# Altium project RFSoC-AMC.PrjPCB (part 18 of 22)

## Sheet FPGA_7A35T.SchDoc: RFSoC AMC
size 420 x 297 mm; CompanyName: WUT; DrawnBy: T. Przywozki; Organization: WUT ISE; Address1: Warsaw University of Technology; Address2: Nowowiejska 15/19 00-665 Warsaw; Address3: Tomasz.Przywozki@pw.edu.pl; DocumentNumber: 15; Revision: 1; SheetNumber: 15; SheetTotal: 45; Project: RFSoC AMC; ModifiedBy: T. Przywozki; CreateDate: -; CheckedDate: -; DivGrp: ISE; Designer: T. Przywozki; ModifiedDate: -; ProjectName: ADC/DAC MEZZANINE
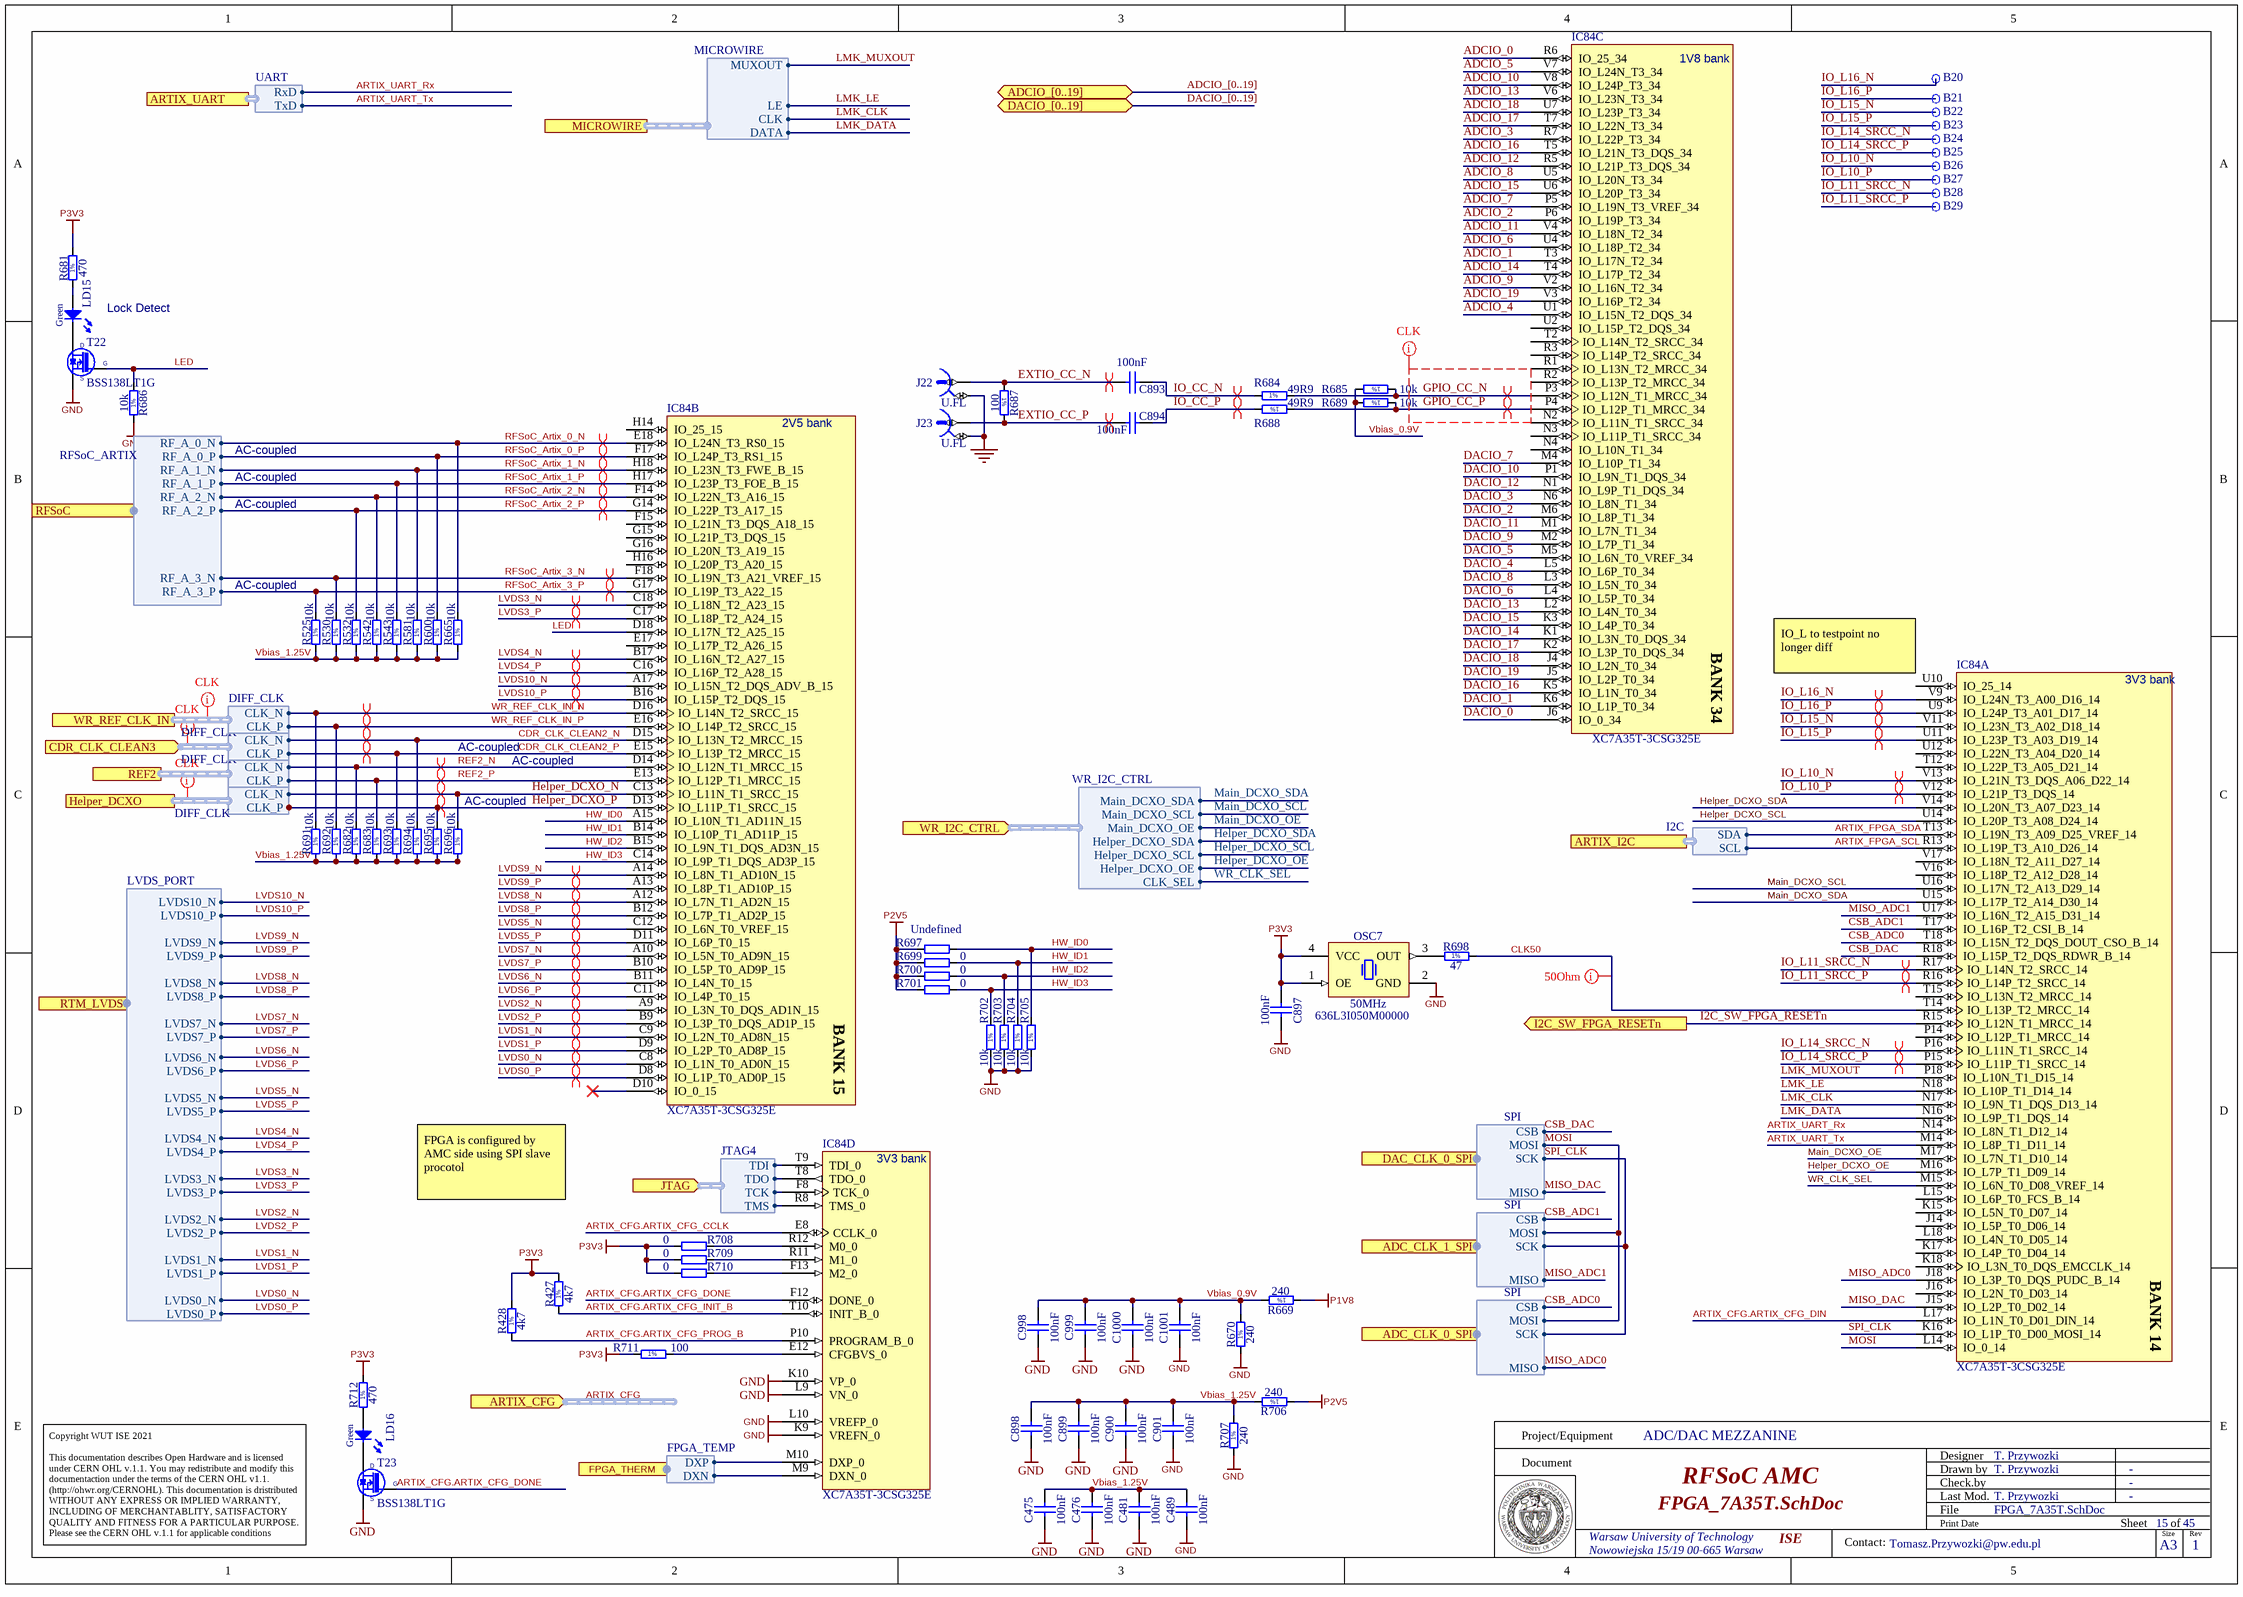
[diagram p40: FPGA_7A35T.SchDoc]

### Parts
B20  SMD_PAD_D1MM  [C100]  (value not drawn)
B21  SMD_PAD_D1MM  [C100]  (value not drawn)
B22  SMD_PAD_D1MM  [C100]  (value not drawn)
B23  SMD_PAD_D1MM  [C100]  (value not drawn)
B24  SMD_PAD_D1MM  [C100]  (value not drawn)
B25  SMD_PAD_D1MM  [C100]  (value not drawn)
B26  SMD_PAD_D1MM  [C100]  (value not drawn)
B27  SMD_PAD_D1MM  [C100]  (value not drawn)
B28  SMD_PAD_D1MM  [C100]  (value not drawn)
B29  SMD_PAD_D1MM  [C100]  (value not drawn)
C475  100nF  [CAPC0603X33N]
C476  100nF  [CAPC0603X33N]
C481  100nF  [CAPC0603X33N]
C489  100nF  [CAPC0603X33N]
C893  100nF  [CAPC1005X55N]
C894  100nF  [CAPC1005X55N]
C897  100nF  [CAPC0603X33N]
C898  100nF  [CAPC0603X33N]
C899  100nF  [CAPC0603X33N]
C900  100nF  [CAPC0603X33N]
C901  100nF  [CAPC0603X33N]
C998  100nF  [CAPC0603X33N]
C999  100nF  [CAPC0603X33N]
C1000  100nF  [CAPC0603X33N]
C1001  100nF  [CAPC0603X33N]
IC84  XC7A35T-3CSG325E  [CSG325]  (parts A,B,C,D of 9)
J22  U.FL  [HIROSE_U.FL-R-SMT-1(10)]
J23  U.FL  [HIROSE_U.FL-R-SMT-1(10)]
LD15  Green  [LED_KINGBRIGHT_KPH-1608CGCK]
LD16  Green  [LED_KINGBRIGHT_KPH-1608CGCK]
OSC7  50MHz  Manufacturer Part Number: 636L3I050M00000  [OSCSC254P320X500X130-4N]
R427  4k7  [RESC1005X40N]
R428  4k7  [RESC1005X40N]
R525  10k  [RESC1005X40N]
R530  10k  [RESC1005X40N]
R532  10k  [RESC1005X40N]
R542  10k  [RESC1005X40N]
R543  10k  [RESC1005X40N]
R581  10k  [RESC1005X40N]
R600  10k  [RESC1005X40N]
R665  10k  [RESC1005X40N]
R669  240  [RESC1005X40N]
R670  240  [RESC1005X40N]
R681  470  [RESC1005X40N]
R682  10k  [RESC1005X40N]
R683  10k  [RESC1005X40N]
R684  49R9  [RESC1005X40N]
R685  10k  [RESC1005X40N]
R686  10k  [RESC1005X40N]
R687  100  [RESC1005X40N]
R688  49R9  [RESC1005X40N]
R689  10k  [RESC1005X40N]
R691  10k  [RESC1005X40N]
R692  10k  [RESC1005X40N]
R693  10k  [RESC1005X40N]
R694  10k  [RESC1005X40N]
R695  10k  [RESC1005X40N]
R696  10k  [RESC1005X40N]
R697  Undefined  [RESC1005X40N]
R698  47  [RESC1005X40N]
R699  0  [RESC1005X40N]
R700  0  [RESC1005X40N]
R701  0  [RESC1005X40N]
R702  10k  [RESC1005X40N]
R703  10k  [RESC1005X40N]
R704  10k  [RESC1005X40N]
R705  10k  [RESC1005X40N]
R706  240  [RESC1005X40N]
R707  240  [RESC1005X40N]
R708  0  [RESC1005X40N]
R709  0  [RESC1005X40N]
R710  0  [RESC1005X40N]
R711  100  [RESC1005X40N]
R712  470  [RESC1005X40N]
T22  BSS138LT1G  [SOT95P240X110-3N]
T23  BSS138LT1G  [SOT95P240X110-3N]

### Ports
ADC_CLK_0_SPI (harness SPI), ADC_CLK_1_SPI (harness SPI), ADCIO_[0..19] (bidir), ARTIX_CFG (in, harness ARTIX_CFG), ARTIX_I2C (harness I2C), ARTIX_UART (harness UART), CDR_CLK_CLEAN3 (in, harness DIFF_CLK), DAC_CLK_0_SPI (harness SPI), DACIO_[0..19] (bidir), FPGA_THERM (harness FPGA_TEMP), Helper_DCXO (harness DIFF_CLK), I2C_SW_FPGA_RESETn (out), JTAG (in, harness JTAG4), MICROWIRE (harness MICROWIRE), REF2 (harness DIFF_CLK), RFSoC (harness RFSoC_ARTIX), RTM_LVDS (harness LVDS_PORT), WR_I2C_CTRL (in, harness WR_I2C_CTRL), WR_REF_CLK_IN (harness DIFF_CLK)

### Harnesses
JTAG4: TCK, TDI, TDO, TMS
UART: RxD, TxD
I2C: SCL, SDA
WR_I2C_CTRL: CLK_SEL, Helper_DCXO_OE, Helper_DCXO_SCL, Helper_DCXO_SDA, Main_DCXO_OE, Main_DCXO_SCL, Main_DCXO_SDA
FPGA_TEMP: DXP, DXN
SPI: MOSI, MISO, CSB, SCK
MICROWIRE: CLK, DATA, LE, MUXOUT
DIFF_CLK: CLK_P, CLK_N
RFSoC_ARTIX: RF_A_0_N, RF_A_0_P, RF_A_1_N, RF_A_1_P, RF_A_2_N, RF_A_2_P, RF_A_3_N, RF_A_3_P
LVDS_PORT: LVDS0_P, LVDS0_N, LVDS1_P, LVDS1_N, LVDS2_P, LVDS2_N, LVDS3_P, LVDS3_N, LVDS4_P, LVDS4_N, LVDS5_P, LVDS5_N, LVDS6_P, LVDS6_N, LVDS7_P, LVDS7_N, LVDS8_P, LVDS8_N, LVDS9_P, LVDS9_N, LVDS10_P, LVDS10_N

### Nets
GND: C475.2 C476.2 C481.2 C489.2 C897.1 C898.2 C899.2 C900.2 C901.2 C998.2 C999.2 C1000.2 C1001.2 IC84.K9(VREFN_0) IC84.K10(VP_0) IC84.L9(VN_0) IC84.L10(VREFP_0) J22.2 J23.2 OSC7.2(GND) R670.1 R686.1 R702.1 R703.1 R704.1 R705.1 R707.1 T22.2(S) T23.2(S)
P1V8: R669.1
P2V5: R697.1 R699.1 R700.1 R701.1 R706.1
P3V3: C897.2 OSC7.1(OE) OSC7.4(VCC) R427.2 R428.2 R681.2 R708.1 R709.1 R710.1 R711.1 R712.2
ADCIO_0: IC84.R6(IO_25_34)
ADCIO_1: IC84.T3(IO_L17N_T2_34)
ADCIO_2: IC84.P6(IO_L19P_T3_34)
ADCIO_3: IC84.R7(IO_L22P_T3_34)
ADCIO_4: IC84.U1(IO_L15N_T2_DQS_34)
ADCIO_5: IC84.V7(IO_L24N_T3_34)
ADCIO_6: IC84.U4(IO_L18P_T2_34)
ADCIO_7: IC84.P5(IO_L19N_T3_VREF_34)
ADCIO_8: IC84.U5(IO_L20N_T3_34)
ADCIO_9: IC84.V2(IO_L16N_T2_34)
ADCIO_10: IC84.V8(IO_L24P_T3_34)
ADCIO_11: IC84.V4(IO_L18N_T2_34)
ADCIO_12: IC84.R5(IO_L21P_T3_DQS_34)
ADCIO_13: IC84.V6(IO_L23N_T3_34)
ADCIO_14: IC84.T4(IO_L17P_T2_34)
ADCIO_15: IC84.U6(IO_L20P_T3_34)
ADCIO_16: IC84.T5(IO_L21N_T3_DQS_34)
ADCIO_17: IC84.T7(IO_L22N_T3_34)
ADCIO_18: IC84.U7(IO_L23P_T3_34)
ADCIO_19: IC84.V3(IO_L16P_T2_34)
ARTIX_CFG.ARTIX_CFG_CCLK: IC84.E8(CCLK_0)
ARTIX_CFG.ARTIX_CFG_DIN: IC84.L17(IO_L1N_T0_D01_DIN_14)
ARTIX_CFG.ARTIX_CFG_DONE: IC84.F12(DONE_0) T23.1(G)
ARTIX_CFG.ARTIX_CFG_INIT_B: IC84.T10(INIT_B_0) R427.1
ARTIX_CFG.ARTIX_CFG_PROG_B: IC84.P10(PROGRAM_B_0) R428.1
ARTIX_FPGA_SCL: IC84.R13(IO_L19P_T3_A10_D26_14) ; port ARTIX_I2C.SCL
ARTIX_FPGA_SDA: IC84.T13(IO_L19N_T3_A09_D25_VREF_14) ; port ARTIX_I2C.SDA
ARTIX_TCK: IC84.F8(TCK_0) ; port JTAG.TCK
ARTIX_TDI: IC84.T9(TDI_0) ; port JTAG.TDI
ARTIX_TDO: IC84.T8(TDO_0) ; port JTAG.TDO
ARTIX_TMS: IC84.R8(TMS_0) ; port JTAG.TMS
ARTIX_UART_Rx: IC84.N14(IO_L8N_T1_D12_14) ; port ARTIX_UART.RxD
ARTIX_UART_Tx: IC84.M14(IO_L8P_T1_D11_14) ; port ARTIX_UART.TxD
CDR_CLK_CLEAN2_N: IC84.D15(IO_L13N_T2_MRCC_15) R694.2 ; port CDR_CLK_CLEAN3.CLK_N
CDR_CLK_CLEAN2_P: IC84.E15(IO_L13P_T2_MRCC_15) R693.2 ; port CDR_CLK_CLEAN3.CLK_P
CLK50: IC84.T14(IO_L13P_T2_MRCC_14) R698.2
CSB_ADC0: IC84.T18(IO_L15N_T2_DQS_DOUT_CSO_B_14) ; port ADC_CLK_0_SPI.CSB
CSB_ADC1: IC84.T17(IO_L16P_T2_CSI_B_14) ; port ADC_CLK_1_SPI.CSB
CSB_DAC: IC84.R18(IO_L15P_T2_DQS_RDWR_B_14) ; port DAC_CLK_0_SPI.CSB
DACIO_0: IC84.J6(IO_0_34)
DACIO_1: IC84.K6(IO_L1P_T0_34)
DACIO_2: IC84.M6(IO_L8P_T1_34)
DACIO_3: IC84.N6(IO_L8N_T1_34)
DACIO_4: IC84.L5(IO_L6P_T0_34)
DACIO_5: IC84.M5(IO_L6N_T0_VREF_34)
DACIO_6: IC84.L4(IO_L5P_T0_34)
DACIO_7: IC84.M4(IO_L10P_T1_34)
DACIO_8: IC84.L3(IO_L5N_T0_34)
DACIO_9: IC84.M2(IO_L7P_T1_34)
DACIO_10: IC84.P1(IO_L9N_T1_DQS_34)
DACIO_11: IC84.M1(IO_L7N_T1_34)
DACIO_12: IC84.N1(IO_L9P_T1_DQS_34)
DACIO_13: IC84.L2(IO_L4N_T0_34)
DACIO_14: IC84.K1(IO_L3N_T0_DQS_34)
DACIO_15: IC84.K3(IO_L4P_T0_34)
DACIO_16: IC84.K5(IO_L1N_T0_34)
DACIO_17: IC84.K2(IO_L3P_T0_DQS_34)
DACIO_18: IC84.J4(IO_L2N_T0_34)
DACIO_19: IC84.J5(IO_L2P_T0_34)
EXTIO_CC_N: C893.1 J22.1 R687.1
EXTIO_CC_P: C894.1 J23.1 R687.2
GPIO_CC_N: IC84.P3(IO_L12N_T1_MRCC_34) R684.2 R685.1
GPIO_CC_P: IC84.P4(IO_L12P_T1_MRCC_34) R688.1 R689.1
Helper_DCXO_N: IC84.C13(IO_L11N_T1_SRCC_15) R696.2 ; port Helper_DCXO.CLK_N
Helper_DCXO_OE: IC84.M16(IO_L7P_T1_D09_14) ; port WR_I2C_CTRL.Helper_DCXO_OE
Helper_DCXO_P: IC84.D13(IO_L11P_T1_SRCC_15) R695.2 ; port Helper_DCXO.CLK_P
Helper_DCXO_SCL: IC84.U14(IO_L20P_T3_A08_D24_14) ; port WR_I2C_CTRL.Helper_DCXO_SCL
Helper_DCXO_SDA: IC84.V14(IO_L20N_T3_A07_D23_14) ; port WR_I2C_CTRL.Helper_DCXO_SDA
HW_ID0: IC84.A15(IO_L10N_T1_AD11N_15) R697.2 R705.2
HW_ID1: IC84.B14(IO_L10P_T1_AD11P_15) R699.2 R704.2
HW_ID2: IC84.B15(IO_L9N_T1_DQS_AD3N_15) R700.2 R703.2
HW_ID3: IC84.C14(IO_L9P_T1_DQS_AD3P_15) R701.2 R702.2
I2C_SW_FPGA_RESETn: IC84.R15(IO_L12N_T1_MRCC_14) ; port I2C_SW_FPGA_RESETn
IO_CC_N: C893.2 R684.1
IO_CC_P: C894.2 R688.2
IO_L10_N: B26.1 IC84.V13(IO_L21N_T3_DQS_A06_D22_14)
IO_L10_P: B27.1 IC84.V12(IO_L21P_T3_DQS_14)
IO_L11_SRCC_N: B28.1 IC84.R17(IO_L14N_T2_SRCC_14)
IO_L11_SRCC_P: B29.1 IC84.R16(IO_L14P_T2_SRCC_14)
IO_L14_SRCC_N: B24.1 IC84.P16(IO_L11N_T1_SRCC_14)
IO_L14_SRCC_P: B25.1 IC84.P15(IO_L11P_T1_SRCC_14)
IO_L15_N: B22.1 IC84.V11(IO_L23N_T3_A02_D18_14)
IO_L15_P: B23.1 IC84.U11(IO_L23P_T3_A03_D19_14)
IO_L16_N: B20.1 IC84.V9(IO_L24N_T3_A00_D16_14)
IO_L16_P: B21.1 IC84.U9(IO_L24P_T3_A01_D17_14)
LED: IC84.D18(IO_L17N_T2_A25_15) R686.2 T22.1(G)
LMK_CLK: IC84.N17(IO_L9N_T1_DQS_D13_14) ; port MICROWIRE.CLK
LMK_DATA: IC84.N16(IO_L9P_T1_DQS_14) ; port MICROWIRE.DATA
LMK_LE: IC84.N18(IO_L10P_T1_D14_14) ; port MICROWIRE.LE
LMK_MUXOUT: IC84.P18(IO_L10N_T1_D15_14) ; port MICROWIRE.MUXOUT
LVDS0_N: IC84.C8(IO_L1N_T0_AD0N_15) ; port RTM_LVDS.LVDS0_N
LVDS0_P: IC84.D8(IO_L1P_T0_AD0P_15) ; port RTM_LVDS.LVDS0_P
LVDS1_N: IC84.C9(IO_L2N_T0_AD8N_15) ; port RTM_LVDS.LVDS1_N
LVDS1_P: IC84.D9(IO_L2P_T0_AD8P_15) ; port RTM_LVDS.LVDS1_P
LVDS2_N: IC84.A9(IO_L3N_T0_DQS_AD1N_15) ; port RTM_LVDS.LVDS2_N
LVDS2_P: IC84.B9(IO_L3P_T0_DQS_AD1P_15) ; port RTM_LVDS.LVDS2_P
LVDS3_N: IC84.C18(IO_L18N_T2_A23_15) ; port RTM_LVDS.LVDS3_N
LVDS3_P: IC84.C17(IO_L18P_T2_A24_15) ; port RTM_LVDS.LVDS3_P
LVDS4_N: IC84.B17(IO_L16N_T2_A27_15) ; port RTM_LVDS.LVDS4_N
LVDS4_P: IC84.C16(IO_L16P_T2_A28_15) ; port RTM_LVDS.LVDS4_P
LVDS5_N: IC84.C12(IO_L6N_T0_VREF_15) ; port RTM_LVDS.LVDS5_N
LVDS5_P: IC84.D11(IO_L6P_T0_15) ; port RTM_LVDS.LVDS5_P
LVDS6_N: IC84.B11(IO_L4N_T0_15) ; port RTM_LVDS.LVDS6_N
LVDS6_P: IC84.C11(IO_L4P_T0_15) ; port RTM_LVDS.LVDS6_P
LVDS7_N: IC84.A10(IO_L5N_T0_AD9N_15) ; port RTM_LVDS.LVDS7_N
LVDS7_P: IC84.B10(IO_L5P_T0_AD9P_15) ; port RTM_LVDS.LVDS7_P
LVDS8_N: IC84.A12(IO_L7N_T1_AD2N_15) ; port RTM_LVDS.LVDS8_N
LVDS8_P: IC84.B12(IO_L7P_T1_AD2P_15) ; port RTM_LVDS.LVDS8_P
LVDS9_N: IC84.A14(IO_L8N_T1_AD10N_15) ; port RTM_LVDS.LVDS9_N
LVDS9_P: IC84.A13(IO_L8P_T1_AD10P_15) ; port RTM_LVDS.LVDS9_P
LVDS10_N: IC84.A17(IO_L15N_T2_DQS_ADV_B_15) ; port RTM_LVDS.LVDS10_N
LVDS10_P: IC84.B16(IO_L15P_T2_DQS_15) ; port RTM_LVDS.LVDS10_P
Main_DCXO_OE: IC84.M17(IO_L7N_T1_D10_14) ; port WR_I2C_CTRL.Main_DCXO_OE
Main_DCXO_SCL: IC84.U16(IO_L17N_T2_A13_D29_14) ; port WR_I2C_CTRL.Main_DCXO_SCL
Main_DCXO_SDA: IC84.U15(IO_L17P_T2_A14_D30_14) ; port WR_I2C_CTRL.Main_DCXO_SDA
MISO_ADC0: IC84.J18(IO_L3P_T0_DQS_PUDC_B_14) ; port ADC_CLK_0_SPI.MISO
MISO_ADC1: IC84.U17(IO_L16N_T2_A15_D31_14) ; port ADC_CLK_1_SPI.MISO
MISO_DAC: IC84.J15(IO_L2P_T0_D02_14) ; port DAC_CLK_0_SPI.MISO
MOSI: IC84.L14(IO_0_14) ; port DAC_CLK_0_SPI.MOSI, port ADC_CLK_1_SPI.MOSI, port ADC_CLK_0_SPI.MOSI
REF2_N: IC84.D14(IO_L12N_T1_MRCC_15) R682.2 ; port REF2.CLK_N  [project net FPGA_REFCLK_OUT_C_N]
REF2_P: IC84.E13(IO_L12P_T1_MRCC_15) R683.2 ; port REF2.CLK_P  [project net FPGA_REFCLK_OUT_C_P]
RFSoC_Artix_0_N: IC84.E18(IO_L24N_T3_RS0_15) R665.2 ; port RFSoC.RF_A_0_N
RFSoC_Artix_0_P: IC84.F17(IO_L24P_T3_RS1_15) R600.2 ; port RFSoC.RF_A_0_P
RFSoC_Artix_1_N: IC84.H18(IO_L23N_T3_FWE_B_15) R581.2 ; port RFSoC.RF_A_1_N
RFSoC_Artix_1_P: IC84.H17(IO_L23P_T3_FOE_B_15) R543.2 ; port RFSoC.RF_A_1_P
RFSoC_Artix_2_N: IC84.F14(IO_L22N_T3_A16_15) R542.2 ; port RFSoC.RF_A_2_N
RFSoC_Artix_2_P: IC84.G14(IO_L22P_T3_A17_15) R532.2 ; port RFSoC.RF_A_2_P
RFSoC_Artix_3_N: IC84.F18(IO_L19N_T3_A21_VREF_15) R530.2 ; port RFSoC.RF_A_3_N
RFSoC_Artix_3_P: IC84.G17(IO_L19P_T3_A22_15) R525.2 ; port RFSoC.RF_A_3_P
SPI_CLK: IC84.K16(IO_L1P_T0_D00_MOSI_14) ; port DAC_CLK_0_SPI.SCK, port ADC_CLK_1_SPI.SCK, port ADC_CLK_0_SPI.SCK
Vbias_0.9V: C998.1 C999.1 C1000.1 C1001.1 R669.2 R670.2 R685.2 R689.2
Vbias_1.25V: C475.1 C476.1 C481.1 C489.1 C898.1 C899.1 C900.1 C901.1 R525.1 R530.1 R532.1 R542.1 R543.1 R581.1 R600.1 R665.1 R682.1 R683.1 R691.1 R692.1 R693.1 R694.1 R695.1 R696.1 R706.2 R707.2
WR_CLK_SEL: IC84.M15(IO_L6N_T0_D08_VREF_14) ; port WR_I2C_CTRL.CLK_SEL
WR_REF_CLK_IN_N: IC84.D16(IO_L14N_T2_SRCC_15) R691.2 ; port WR_REF_CLK_IN.CLK_N
WR_REF_CLK_IN_P: IC84.E16(IO_L14P_T2_SRCC_15) R692.2 ; port WR_REF_CLK_IN.CLK_P
NetC815_2: IC84.M10(DXP_0) ; port FPGA_THERM.DXP
NetIC84_E12: IC84.E12(CFGBVS_0) R711.2
NetIC84_F13: IC84.F13(M2_0) R710.2
NetIC84_M9: IC84.M9(DXN_0) ; port FPGA_THERM.DXN
NetIC84_R11: IC84.R11(M1_0) R709.2
NetIC84_R12: IC84.R12(M0_0) R708.2
NetLD15_1: LD15.1(C) T22.3(D)
NetLD15_2: LD15.2(A) R681.1
NetLD16_1: LD16.1(C) T23.3(D)
NetLD16_2: LD16.2(A) R712.1
NetOSC7_3: OSC7.3(OUT) R698.1

Not connected (* = marked no-connect by the designer): IC84 D10(IO_0_15)* E17(IO_L17P_T2_A26_15) F15(IO_L21N_T3_DQS_A18_15) G15(IO_L21P_T3_DQS_15) G16(IO_L20N_T3_A19_15) H14(IO_25_15) H16(IO_L20P_T3_A20_15) J14(IO_L5P_T0_D06_14) J16(IO_L2N_T0_D03_14) K15(IO_L5N_T0_D07_14) K17(IO_L4P_T0_D04_14) K18(IO_L3N_T0_DQS_EMCCLK_14) L15(IO_L6P_T0_FCS_B_14) L18(IO_L4N_T0_D05_14) N2(IO_L11N_T1_SRCC_34) N3(IO_L11P_T1_SRCC_34) N4(IO_L10N_T1_34) P14(IO_L12P_T1_MRCC_14) R1(IO_L13N_T2_MRCC_34) R2(IO_L13P_T2_MRCC_34) R3(IO_L14P_T2_SRCC_34) T2(IO_L14N_T2_SRCC_34) T12(IO_L22P_T3_A05_D21_14) T15(IO_L13N_T2_MRCC_14) U2(IO_L15P_T2_DQS_34) U10(IO_25_14) U12(IO_L22N_T3_A04_D20_14) V16(IO_L18P_T2_A12_D28_14) V17(IO_L18N_T2_A11_D27_14)

### Buses and harness runs
bus ADCIO_[0..19] = port ADCIO_[0..19]
bus DACIO_[0..19] = port DACIO_[0..19]
harness ARTIX_CFG = port ARTIX_CFG

### Layout directives
net class CLK: (no net found under the mark), GPIO_CC_N, GPIO_CC_P
differential pair: EXTIO_CC_N, EXTIO_CC_P, GPIO_CC_N, GPIO_CC_P, IO_CC_N, IO_CC_P, IO_L10_N, IO_L10_P, IO_L11_SRCC_N, IO_L11_SRCC_P, IO_L14_SRCC_N, IO_L14_SRCC_P, IO_L15_N, IO_L15_P, IO_L16_N, IO_L16_P
net class SE50: CLK50
differential pair; differential pair class 100Ohm; net class Artix_CLK: CDR_CLK_CLEAN2_N, CDR_CLK_CLEAN2_P, FPGA_REFCLK_OUT_C_N, FPGA_REFCLK_OUT_C_P, Helper_DCXO_N, Helper_DCXO_P, WR_REF_CLK_IN_N, WR_REF_CLK_IN_P
differential pair; differential pair class 100Ohm; net class RFSoC_Artix: RFSoC_Artix_0_N, RFSoC_Artix_0_P, RFSoC_Artix_1_N, RFSoC_Artix_1_P, RFSoC_Artix_2_N, RFSoC_Artix_2_P, RFSoC_Artix_3_N, RFSoC_Artix_3_P
differential pair; differential pair class 100Ohm; net class RTM_LVDS: LVDS0_N, LVDS0_P, LVDS1_N, LVDS1_P, LVDS2_N, LVDS2_P, LVDS3_N, LVDS3_P, LVDS4_N, LVDS4_P, LVDS5_N, LVDS5_P, LVDS6_N, LVDS6_P, LVDS7_N, LVDS7_P, LVDS8_N, LVDS8_P, LVDS9_N, LVDS9_P, LVDS10_N, LVDS10_P

### Notes on the sheet
- 1V8 bank
- Lock Detect
- AC-coupled
- 2V5 bank
- (near IC84) IO_L to testpoint no longer diff
- 3V3 bank
- FPGA is configured by AMC side using SPI slave procotol
- Project/Equipment
- Document
- Designer
- Drawn by
- Check.by
- Copyright WUT ISE 2021
  This documentation describes Open Hardware and is licensed under CERN OHL v.1.1. You may redistribute and modify this documentaction under the terms of the CERN OHL v1.1.
  (http://ohwr.org/CERNOHL). This documentation is dristributed WITHOUT ANY EXPRESS OR IMPLIED WARRANTY, INCLUDING OF MERCHANTABLITY, SATISFACTORY QUALITY AND FITNESS FOR A PARTICULAR PURPOSE. Please see the CERN OHL v.1.1 for applicable conditions
- File
- Last Mod.
- Print Date
- Sheet
- Size
- A3
- of
- Rev
- Contact:
- (in symbol CMP-0383-00015-1, part A) BANK 14
- (in symbol CMP-0383-00015-1, part B) BANK 15
- (in symbol CMP-0383-00015-1, part C) BANK 34
- (in symbol R0402_4K7_1%_0.0625W_100PPM) 1%
- (in symbol R0402_10K_1%_0.0625W_100PPM) 1%
- (in symbol R0402_47R_1%_0.0625W_100PPM) 1%
- (in symbol R0402_49R9_1%_0.0625W_100PPM) 1%
- (in symbol R0402_100R_1%_0.1W_100PPM) 1%
- (in symbol R0402_100R_1%_0.0625W_100PPM) 1%
- (in symbol R0402_240R_1%_0.0625W_100PPM) 1%
- (in symbol R0402_470R_1%_0.0625W_100PPM) 1%

### Library data of the parts
B20-B29 = C100: $$NotCommonProperty_Partition: Pads; Part Description: 1mm Diameter SMD Pad; $$Internal_Resolution: 00001mm; $$NotCommonProperty_Family: SMD Pad; $$NotCommonProperty_Mounted: No; $$NotCommonProperty_Pin Count: 1; $$NotCommonProperty_Sense: No; $$NotCommonProperty_Status: None; CmpIndex: 236; Ref Designator: B5; SymIndex: 2108; $$NotCommonProperty_ComponentHeight: 0mm; $$NotCommonProperty_Footprint Ref: C100; $$NotCommonProperty_SMD: No; $$NotCommonProperty_Socket: No; Cell Name: C100; PackageDescription: 1mm Diameter SMD Pad; Part Name: SMD_PAD_D1MM; Part Number: SMD_PAD_D1MM; Orientation: 0 = 0
C475 C476 C481 C489 C897-C901 C998-C1001 = CC0201_100NF_6.3V_10%_X5R: Non-polarised capacitor; Manufacturer: GENERIC; Manufacturer1 Part Number: 02016D104KAT2A; Part Description: SMD Multilayer Chip Ceramic Capacitor; TC: X5R; Tolerance: ±10%; Voltage: 6.3V; Case: 0201; Manufacturer Part Number: CC0201_100NF_6.3V_10%_X5R; Manufacturer1 Example: AVX; Part Number: CC0201_100NF_6.3V_10%_X5R; Pin Count: 2; SMD: Yes; Status: Not Recommended; Value: 100nF; Component Kind: Standard; Component Type: Standard; Mounted: Yes; Socket: No; Sense: No; Manufacturer1 ComponentHeight: 0.33mm; HelpURL: \\cern.ch\dfs\Applications\Altium\Datasheets\CC0201_X5R_AVX.pdf; Author: CERN DEM JLC; CreateDate: 03.12.2007; LatestRevisionDate: 03.12.2007
C893 C894 = CC0402_100NF_16V_10%_X5R: Non-polarised capacitor; Manufacturer: GENERIC; Manufacturer1 Part Number: GRM155R61C104KA88D; Part Description: SMD Multilayer Chip Ceramic Capacitor; TC: X5R; Tolerance: ±10%; Voltage: 16V; Case: 0402; Manufacturer Part Number: CC0402_100NF_16V_10%_X5R; Manufacturer1 Example: MURATA; Part Number: CC0402_100NF_16V_10%_X5R; Pin Count: 2; SMD: Yes; Status: None; Value: 100nF; Component Kind: Standard; Component Type: Standard; Mounted: Yes; Socket: No; Sense: No; Manufacturer1 ComponentHeight: 0.55mm; HelpURL: \\cern.ch\dfs\Applications\Altium\Datasheets\CC0402_X5R_MURATA_GRM.pdf; Author: CERN DEM JLC; CreateDate: 10.12.2013; LatestRevisionDate: 10.12.2013
IC84 = CMP-0383-00015-1: Artix-7 FPGA, 150 User I/Os, 4 GTP, 324-Ball BGA, Speed Grade 3, Extended Grade, Pb-Free; Manufacturer: Xilinx; CMTs: 5; Available User I/O: 150; GTP: 4; Speed Grades: 3; Total Block RAM: 1800 Kb; Logic Cells: 33280; ComponentLink3URL: http://www.xilinx.com/support/documentation/user_guides/ug475_7Series_Pkg_Pinout.pdf; ComponentLink3Description: Pinout; Operating Temperature Range: Extended; PackageReference: CSG-325; PackageDescription: 324-Ball Wire-Bond Chip-Scale BGA, Body 15 x 15 mm, Pitch 0.8 mm; ComponentLink4URL: http://www.xilinx.com/support/documentation/user_guides/ug475_7Series_Pkg_Pinout.pdf; ComponentLink1Description: Manufacturer URL; ComponentLink2Description: Datasheet; DatasheetVersion: Rev. 1.15; PartNumber: XC7A35T-3CSG325E; Mounting Technology: Surface Mount; ComponentLink1URL: http://www.xilinx.com/; PackageVersion: Rev. 1.11; ComponentLink2URL: http://www.xilinx.com/support/documentation/data_sheets/ds180_7Series_Overview.pdf; Maximum Distributed RAM: 400 Kb; ComponentLink4Description: Package Specification
J22 J23 = HIROSE_U.FL-R-SMT-1(10): Part Description: Up to 6GHz Ultra Small Surface Mount Male Coaxial Connectors U.FL Series; Manufacturer: HIROSE (HRS); PressFit: No; Part Number: HIROSE_U.FL-R-SMT-1(10); Component Kind: Standard; Component Type: Standard; Pin Count: 2; Family: U.FL; Mounted: Yes; Socket: No; SMD: Yes; Sense: No; Status: None; Manufacturer Part Number: U.FL-R-SMT-1(10); ComponentHeight: 1.25mm; HelpURL: \\cern.ch\dfs\Applications\Altium\Datasheets\HIROSE_U.FL-R-SMT-1(10).pdf; Author: CERN DEM JLC; CreateDate: 24.03.2010; LatestRevisionDate: 24.03.2010
LD15 LD16 = LED_KINGBRIGHT_KPH-1608CGCK: LED Green 1C 2A; Part Description: SMD Green LED, Case 1.6mmX0.8mm(0603), 0.65mm Thickness; Bonding: No; PressFit: No; Author: CERN DEM JLC; Color: Green; Component Kind: Standard; Component Type: Standard; ComponentHeight: 0.65mm; CreateDate: 03.07.2017; HelpURL: \\cern.ch\dfs\Applications\Altium\Datasheets\LED_KINGBRIGHT_KPH-1608CGCK.pdf; LatestRevisionDate: 03.07.2017; Manufacturer Part Number: KPH-1608CGCK; Manufacturer: KINGBRIGHT; Mounted: Yes; PackageDescription: SMT Green LED, Case 0603, Body L 1.6 x W 0.8mm H 0.65mm; Part Number: LED_KINGBRIGHT_KPH-1608CGCK; Pin Count: 2; Sense: No; SMD: Yes; Socket: No
OSC7 = OSC_50MHZ_CTS_636L3I050M00000: Oscillator 4 pins 1=OE 2=GND 3=OUT 4=VCC; Manufacturer: CTS ELECTRONIC COMPONENTS; Part Description: 3.3V, ±50ppm, 30pF, -40..85°C, HCMOS/TTL Clock Oscillator, 636 Series; Bonding: No; PressFit: No; Author: CERN DEM JMW; Component Kind: Standard; Component Type: Standard; ComponentHeight: 1.3mm; CreateDate: 22.09.2015; HelpURL: \\cern.ch\dfs\Applications\Altium\Datasheets\OSC_CTS_636.pdf; LatestRevisionDate: 22.09.2015; Mounted: Yes; PackageDescription: Oscillator, Side Concave; 2.54mm Pitch; 4 pin, 3.20mm L X 5.00mm W X 1.30mm H, IPC Medium Density; Part Number: OSC_50MHZ_CTS_636L3I050M00000; Pin Count: 4; Sense: No; SMD: Yes; Socket: No; Value: 50MHz
R427 R428 = R0402_4K7_1%_0.0625W_100PPM: Resistor - 1%; Manufacturer: GENERIC; Part Description: General Purpose Thick Film Chip Resistor; Manufacturer1 Part Number: 232270674702L; TC: ±100ppm/°C; PressFit: No; Manufacturer Part Number: R0402_4K7_1%_0.0625W_100PPM; Part Number: R0402_4K7_1%_0.0625W_100PPM; Tolerance: ±1%; Value: 4k7; Component Kind: Standard; Component Type: Standard; Pin Count: 2; Status: Not Recommended; Power: 0.0625W; Case: 0402; Mounted: Yes; Sense: No; Socket: No; SMD: Yes; Manufacturer1 Example: YAGEO PHYCOMP; Manufacturer1 ComponentHeight: 0.4mm; HelpURL: \\cern.ch\dfs\Applications\Altium\Datasheets\R0402_Phycomp_RC0402.pdf; Author: CERN DEM JLC; CreateDate: 03.12.2007; LatestRevisionDate: 17.10.2012
R525 R530 R532 R542 R543 R581 R600 R665 R682 R683 R691-R696 = R0402_10K_1%_0.0625W_100PPM: Resistor - 1%; Manufacturer: GENERIC; Manufacturer1 Part Number: 232270671003L; Part Description: General Purpose Thick Film Chip Resistor; PressFit: No; TC: ±100ppm/°C; Author: CERN DEM JLC; Case: 0402; Component Kind: Standard; Component Type: Standard; CreateDate: 03.12.2007; HelpURL: \\cern.ch\dfs\Applications\Altium\Datasheets\R0402_Phycomp_RC0402.pdf; LatestRevisionDate: 17.10.2012; Manufacturer Part Number: R0402_10K_1%_0.0625W_100PPM; Manufacturer1 ComponentHeight: 0.4mm; Manufacturer1 Example: YAGEO PHYCOMP; Mounted: Yes; Part Number: R0402_10K_1%_0.0625W_100PPM; Pin Count: 2; Power: 0.0625W; Sense: No; SMD: Yes; Socket: No; Status: Not Recommended; Tolerance: ±1%; Value: 10k
R669 R670 R706 R707 = R0402_240R_1%_0.0625W_100PPM: Resistor - 1%; Manufacturer: GENERIC; Manufacturer1 Part Number: 232270672401L; Part Description: General Purpose Thick Film Chip Resistor; TC: ±100ppm/°C; PressFit: No; Case: 0402; Manufacturer Part Number: R0402_240R_1%_0.0625W_100PPM; Manufacturer1 ComponentHeight: 0.4mm; Manufacturer1 Example: YAGEO PHYCOMP; Part Number: R0402_240R_1%_0.0625W_100PPM; Pin Count: 2; Power: 0.0625W; Sense: No; SMD: Yes; Status: Not Recommended; Tolerance: ±1%; Value: 240; Component Kind: Standard; Component Type: Standard; Mounted: Yes; Socket: No; HelpURL: \\cern.ch\dfs\Applications\Altium\Datasheets\R0402_Phycomp_RC0402.pdf; Author: CERN DEM JLC; CreateDate: 03.12.2007; LatestRevisionDate: 17.10.2012
R681 R712 = R0402_470R_1%_0.0625W_100PPM: Resistor - 1%; Manufacturer: GENERIC; Manufacturer1 Part Number: 232270674701L; Part Description: General Purpose Thick Film Chip Resistor; PressFit: No; TC: ±100ppm/°C; Author: CERN DEM JLC; Case: 0402; Component Kind: Standard; Component Type: Standard; CreateDate: 03.12.2007; HelpURL: \\cern.ch\dfs\Applications\Altium\Datasheets\R0402_Phycomp_RC0402.pdf; LatestRevisionDate: 17.10.2012; Manufacturer Part Number: R0402_470R_1%_0.0625W_100PPM; Manufacturer1 ComponentHeight: 0.4mm; Manufacturer1 Example: YAGEO PHYCOMP; Mounted: Yes; Part Number: R0402_470R_1%_0.0625W_100PPM; Pin Count: 2; Power: 0.0625W; Sense: No; SMD: Yes; Socket: No; Status: Not Recommended; Tolerance: ±1%; Value: 470
R684 R688 = R0402_49R9_1%_0.0625W_100PPM: Resistor - 1%; Manufacturer: GENERIC; Part Description: General Purpose Thick Film Chip Resistor; Manufacturer1 Part Number: 232270674999L or RC0402FR-0749R9L; TC: ±100ppm/°C; PressFit: No; Manufacturer Part Number: R0402_49R9_1%_0.0625W_100PPM; Part Number: R0402_49R9_1%_0.0625W_100PPM; Tolerance: ±1%; Value: 49R9; Component Kind: Standard; Component Type: Standard; Pin Count: 2; Status: Not Recommended; Power: 0.0625W; Case: 0402; Mounted: Yes; Sense: No; Socket: No; SMD: Yes; Manufacturer1 Example: YAGEO PHYCOMP; Manufacturer1 ComponentHeight: 0.4mm; HelpURL: \\cern.ch\dfs\Applications\Altium\Datasheets\R0402_Phycomp_RC0402.pdf; Author: CERN DEM JLC; CreateDate: 24.10.2012; LatestRevisionDate: 24.10.2012
R685 R686 R689 R702-R705 = R0402_10K_1%_0.0625W_100PPM: Resistor - 1%; Manufacturer: GENERIC; Manufacturer1 Part Number: 232270671003L; Part Description: General Purpose Thick Film Chip Resistor; TC: ±100ppm/°C; PressFit: No; Case: 0402; Manufacturer Part Number: R0402_10K_1%_0.0625W_100PPM; Manufacturer1 ComponentHeight: 0.4mm; Manufacturer1 Example: YAGEO PHYCOMP; Part Number: R0402_10K_1%_0.0625W_100PPM; Pin Count: 2; Power: 0.0625W; Sense: No; SMD: Yes; Status: Not Recommended; Tolerance: ±1%; Value: 10k; Component Kind: Standard; Component Type: Standard; Mounted: Yes; Socket: No; HelpURL: \\cern.ch\dfs\Applications\Altium\Datasheets\R0402_Phycomp_RC0402.pdf; Author: CERN DEM JLC; CreateDate: 03.12.2007; LatestRevisionDate: 17.10.2012
R687 = R0402_100R_1%_0.0625W_100PPM: Resistor - 1%; Manufacturer: GENERIC; Part Description: General Purpose Thick Film Chip Resistor; Manufacturer1 Part Number: 232270671001L; TC: ±100ppm/°C; PressFit: No; Manufacturer Part Number: R0402_100R_1%_0.0625W_100PPM; Part Number: R0402_100R_1%_0.0625W_100PPM; Tolerance: ±1%; Value: 100; Component Kind: Standard; Component Type: Standard; Pin Count: 2; Status: Not Recommended; Power: 0.0625W; Case: 0402; Mounted: Yes; Sense: No; Socket: No; SMD: Yes; Manufacturer1 Example: YAGEO PHYCOMP; Manufacturer1 ComponentHeight: 0.4mm; HelpURL: \\cern.ch\dfs\Applications\Altium\Datasheets\R0402_Phycomp_RC0402.pdf; Author: CERN DEM JLC; CreateDate: 03.12.2007; LatestRevisionDate: 17.10.2012
R697 = R0402_NO-VALUE: Resistor; Part Description: Reserved Footprint For a 0402 (1005) Chip Resistor; PressFit: No; Mounted: No; Case: 0402; Manufacturer Part Number: R0402_NO-VALUE; Manufacturer: Undefined; Manufacturer1 ComponentHeight: Undefined; Manufacturer1 Example: Undefined; Manufacturer1 Part Number: Undefined; Part Number: R0402_NO-VALUE; Pin Count: 2; Sense: No; SMD: Yes; Status: None; Value: Undefined; Component Kind: Standard; Component Type: Standard; Socket: No; HelpURL: Undefined; Author: CERN DEM JLC; CreateDate: 03.12.2007; LatestRevisionDate: 13.03.2008
R698 = R0402_47R_1%_0.0625W_100PPM: Resistor - 1%; Part Description: General Purpose Thick Film Chip Resistor; Manufacturer: GENERIC; Manufacturer1 Part Number: 232270674709L; TC: ±100ppm/°C; PressFit: No; Part Number: R0402_47R_1%_0.0625W_100PPM; Component Kind: Standard; Component Type: Standard; Pin Count: 2; Value: 47; Status: Not Recommended; Power: 0.0625W; Tolerance: ±1%; Manufacturer Part Number: R0402_47R_1%_0.0625W_100PPM; Case: 0402; Mounted: Yes; Sense: No; Socket: No; SMD: Yes; Manufacturer1 Example: YAGEO PHYCOMP; Manufacturer1 ComponentHeight: 0.4mm; HelpURL: \\cern.ch\dfs\Applications\Altium\Datasheets\R0402_Phycomp_RC0402.pdf; Author: CERN DEM JLC; CreateDate: 03.12.2007; LatestRevisionDate: 17.10.2012
R699-R701 R708-R710 = R0402_0R_JUMPER: Resistor; Manufacturer: GENERIC; Manufacturer1 Part Number: 232270591001L; Part Description: 1A (0.05R Max DC Resistance) Zero Ohm Jumper; PressFit: No; Case: 0402; Manufacturer Part Number: R0402_0R_JUMPER; Manufacturer1 ComponentHeight: 0.4mm; Manufacturer1 Example: YAGEO PHYCOMP; Part Number: R0402_0R_JUMPER; Pin Count: 2; Sense: No; SMD: Yes; Status: Not Recommended; Value: 0; Component Kind: Standard; Component Type: Standard; Mounted: Yes; Socket: No; HelpURL: \\cern.ch\dfs\Applications\Altium\Datasheets\R0402_Phycomp_RC0402.pdf; Author: CERN DEM JLC; CreateDate: 03.12.2007; LatestRevisionDate: 17.10.2012
R711 = R0402_100R_1%_0.1W_100PPM: Resistor - 1%; Manufacturer Part Number: R0402_100R_1%_0.1W_100PPM_50V; Manufacturer: GENERIC; Manufacturer1 Part Number: ERJ2RKF1000X; Part Description: General Purpose Thick Film Chip Resistor; Power: 0.1W; TC: ±100ppm/°C; Voltage: 50V; PressFit: No; Case: 0402; Manufacturer1 ComponentHeight: 0.4mm; Manufacturer1 Example: PANASONIC; Part Number: R0402_100R_1%_0.1W_100PPM; Pin Count: 2; Sense: No; SMD: Yes; Status: Not Recommended; Tolerance: ±1%; Value: 100; Component Kind: Standard; Component Type: Standard; Mounted: Yes; Socket: No; HelpURL: \\cern.ch\dfs\Applications\Altium\Datasheets\R0402_PANASONIC_ERJ2RK.pdf; Author: CERN DEM JLC; CreateDate: 12.12.2013; LatestRevisionDate: 03.03.2015
T22 T23 = BSS138LT1G: N-CHANNEL MOSFET WITH DIODE; Manufacturer: ON SEMICONDUCTOR; Part Description: 50V 200mA N-Channel Enhancement Mode Field-Effect Transistor; Bonding: No; PressFit: No; Case: SOT23-3; ComponentHeight: 1.11mm; Device: BSS138LT1G; Manufacturer Part Number: BSS138LT1G; Mounted: Yes; PackageDescription: SOT23 3-Leads, Pitch 0.95mm - Body 1.4x3mm, IPC Medium Density; Part Number: BSS138LT1G; Pin Count: 3; Sense: No; SMD: Yes; Socket: No; Component Kind: Standard; Component Type: Standard; HelpURL: \\cern.ch\dfs\Applications\Altium\Datasheets\BSS138LT1G.pdf; Author: CERN DEM JLC; CreateDate: 23.03.2009; LatestRevisionDate: 23.03.2009

## Sheet FPGA_7A35T_GTP.SchDoc: RFSoC AMC
size 420 x 297 mm; CompanyName: WUT; DrawnBy: T. Przywozki; Organization: WUT ISE; Address1: Warsaw University of Technology; Address2: Nowowiejska 15/19 00-665 Warsaw; Address3: Tomasz.Przywozki@pw.edu.pl; DocumentNumber: 16; Revision: 1; SheetNumber: 16; SheetTotal: 45; Project: RFSoC AMC; ModifiedBy: T. Przywozki; CreateDate: -; CheckedDate: -; DivGrp: ISE; Designer: T. Przywozki; ModifiedDate: -; ProjectName: ADC/DAC MEZZANINE
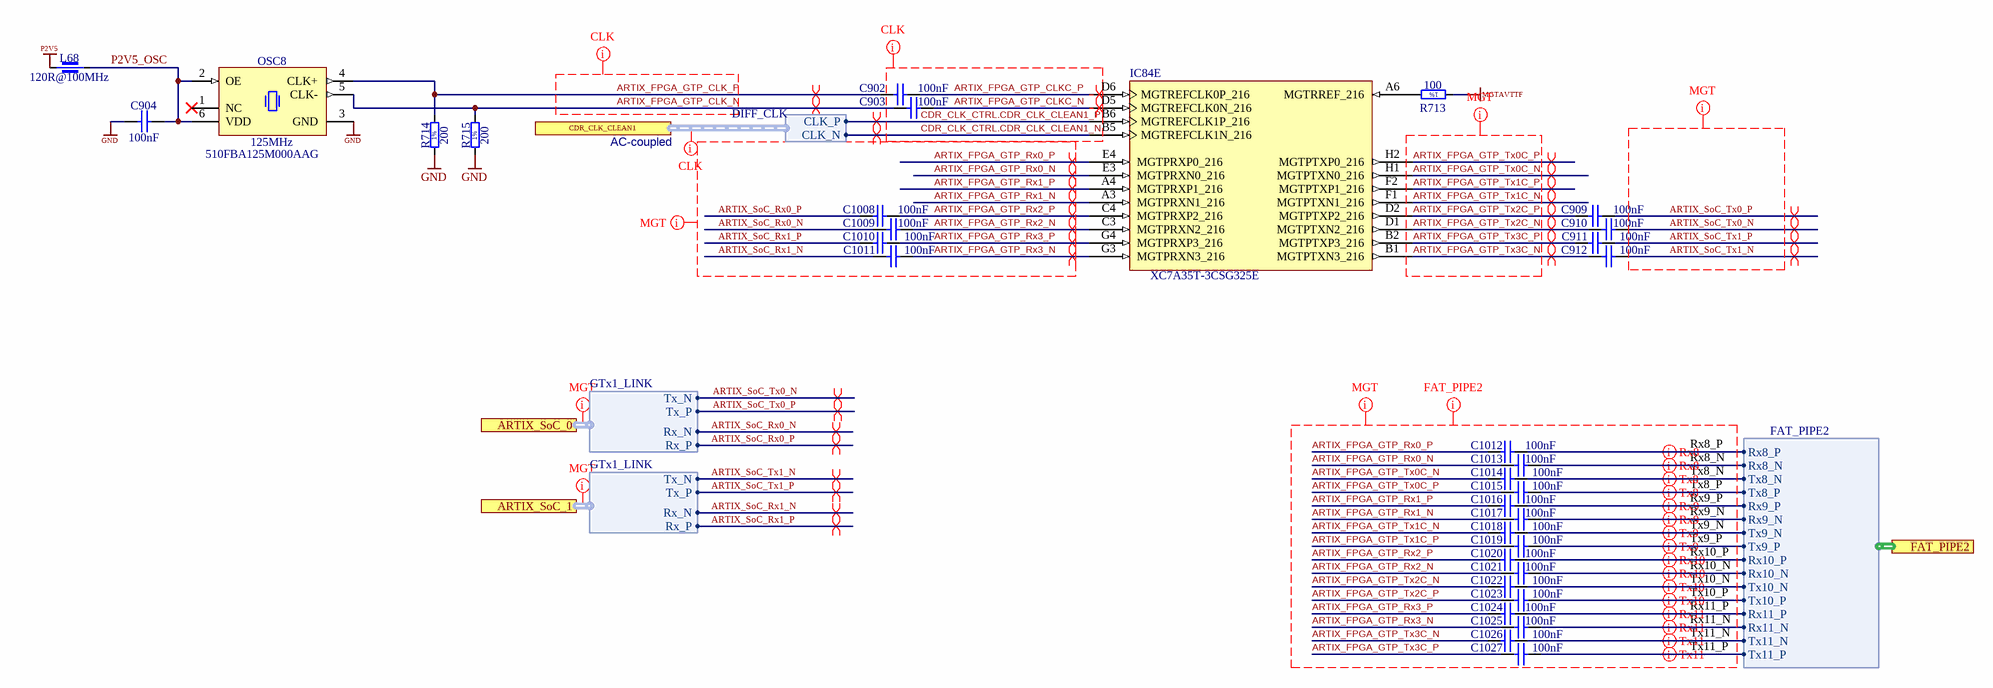
[diagram p41: FPGA_7A35T_GTP.SchDoc]

### Parts
C902  100nF  [CAPC0603X33N]
C903  100nF  [CAPC0603X33N]
C904  100nF  [CAPC0603X33N]
C909  100nF  [CAPC0603X33N]
C910  100nF  [CAPC0603X33N]
C911  100nF  [CAPC0603X33N]
C912  100nF  [CAPC0603X33N]
C1008  100nF  [CAPC0603X33N]
C1009  100nF  [CAPC0603X33N]
C1010  100nF  [CAPC0603X33N]
C1011  100nF  [CAPC0603X33N]
C1012  100nF  [CAPC0603X33N]
C1013  100nF  [CAPC0603X33N]
C1014  100nF  [CAPC0603X33N]
C1015  100nF  [CAPC0603X33N]
C1016  100nF  [CAPC0603X33N]
C1017  100nF  [CAPC0603X33N]
C1018  100nF  [CAPC0603X33N]
C1019  100nF  [CAPC0603X33N]
C1020  100nF  [CAPC0603X33N]
C1021  100nF  [CAPC0603X33N]
C1022  100nF  [CAPC0603X33N]
C1023  100nF  [CAPC0603X33N]
C1024  100nF  [CAPC0603X33N]
C1025  100nF  [CAPC0603X33N]
C1026  100nF  [CAPC0603X33N]
C1027  100nF  [CAPC0603X33N]
IC84  XC7A35T-3CSG325E  [CSG325]  (part E of 9)
L68  120R@100MHz  [INDC1005X55N]
OSC8  125MHz  Manufacturer Part Number: 510FBA125M000AAG  [OSC_SILICON-LAB_SI510-6N(5X7)]
R713  100  [RESC1005X40N]
R714  200  [RESC1005X40N]
R715  200  [RESC1005X40N]

### Ports
ARTIX_SoC_0 (harness GTx1_LINK), ARTIX_SoC_1 (harness GTx1_LINK), CDR_CLK_CLEAN1 (harness DIFF_CLK), FAT_PIPE2 (harness FAT_PIPE2)

### Harnesses
GTx1_LINK: Rx_P, Rx_N, Tx_P, Tx_N
DIFF_CLK: CLK_P, CLK_N
FAT_PIPE2: Rx8_P, Rx8_N, Tx8_N, Tx8_P, Rx9_P, Rx9_N, Tx9_N, Tx9_P, Rx10_P, Rx10_N, Tx10_N, Tx10_P, Rx11_P, Rx11_N, Tx11_N, Tx11_P

### Nets
GND: C904.1 OSC8.3(GND) R714.1 R715.1
MGTAVTTF: R713.1
P2V5: L68.2
ARTIX_FPGA_GTP_CLK_N: C903.1 OSC8.5(CLK-) R715.2
ARTIX_FPGA_GTP_CLK_P: C902.1 OSC8.4(CLK+) R714.2
ARTIX_FPGA_GTP_CLKC_N: C903.2 IC84.D5(MGTREFCLK0N_216)
ARTIX_FPGA_GTP_CLKC_P: C902.2 IC84.D6(MGTREFCLK0P_216)
ARTIX_FPGA_GTP_Rx0_N: C1013.2 IC84.E3(MGTPRXN0_216)
ARTIX_FPGA_GTP_Rx0_P: C1012.2 IC84.E4(MGTPRXP0_216)
ARTIX_FPGA_GTP_Rx1_N: C1017.2 IC84.A3(MGTPRXN1_216)
ARTIX_FPGA_GTP_Rx1_P: C1016.2 IC84.A4(MGTPRXP1_216)
ARTIX_FPGA_GTP_Rx2_N: C1009.1 C1021.2 IC84.C3(MGTPRXN2_216)
ARTIX_FPGA_GTP_Rx2_P: C1008.1 C1020.2 IC84.C4(MGTPRXP2_216)
ARTIX_FPGA_GTP_Rx3_N: C1011.1 C1025.2 IC84.G3(MGTPRXN3_216)
ARTIX_FPGA_GTP_Rx3_P: C1010.1 C1024.2 IC84.G4(MGTPRXP3_216)
ARTIX_FPGA_GTP_Tx0C_N: C1014.2 IC84.H1(MGTPTXN0_216)
ARTIX_FPGA_GTP_Tx0C_P: C1015.2 IC84.H2(MGTPTXP0_216)
ARTIX_FPGA_GTP_Tx1C_N: C1018.2 IC84.F1(MGTPTXN1_216)
ARTIX_FPGA_GTP_Tx1C_P: C1019.2 IC84.F2(MGTPTXP1_216)
ARTIX_FPGA_GTP_Tx2C_N: C910.2 C1022.2 IC84.D1(MGTPTXN2_216)
ARTIX_FPGA_GTP_Tx2C_P: C909.2 C1023.2 IC84.D2(MGTPTXP2_216)
ARTIX_FPGA_GTP_Tx3C_N: C912.2 C1026.2 IC84.B1(MGTPTXN3_216)
ARTIX_FPGA_GTP_Tx3C_P: C911.2 C1027.2 IC84.B2(MGTPTXP3_216)
ARTIX_SoC_Rx0_N: C1009.2 ; port ARTIX_SoC_0.Rx_N
ARTIX_SoC_Rx0_P: C1008.2 ; port ARTIX_SoC_0.Rx_P
ARTIX_SoC_Rx1_N: C1011.2 ; port ARTIX_SoC_1.Rx_N
ARTIX_SoC_Rx1_P: C1010.2 ; port ARTIX_SoC_1.Rx_P
ARTIX_SoC_Tx0_N: C910.1 ; port ARTIX_SoC_0.Tx_N
ARTIX_SoC_Tx0_P: C909.1 ; port ARTIX_SoC_0.Tx_P
ARTIX_SoC_Tx1_N: C912.1 ; port ARTIX_SoC_1.Tx_N
ARTIX_SoC_Tx1_P: C911.1 ; port ARTIX_SoC_1.Tx_P
CDR_CLK_CTRL.CDR_CLK_CLEAN1_N: IC84.B5(MGTREFCLK1N_216) ; port CDR_CLK_CLEAN1.CLK_N
CDR_CLK_CTRL.CDR_CLK_CLEAN1_P: IC84.B6(MGTREFCLK1P_216) ; port CDR_CLK_CLEAN1.CLK_P
P2V5_OSC: C904.2 L68.1 OSC8.2(OE) OSC8.6(VDD)
Rx8_N: C1013.1 ; port FAT_PIPE2.Rx8_N
Rx8_P: C1012.1 ; port FAT_PIPE2.Rx8_P
Rx9_N: C1017.1 ; port FAT_PIPE2.Rx9_N
Rx9_P: C1016.1 ; port FAT_PIPE2.Rx9_P
Rx10_N: C1021.1 ; port FAT_PIPE2.Rx10_N
Rx10_P: C1020.1 ; port FAT_PIPE2.Rx10_P
Rx11_N: C1025.1 ; port FAT_PIPE2.Rx11_N
Rx11_P: C1024.1 ; port FAT_PIPE2.Rx11_P
Tx8_N: C1014.1 ; port FAT_PIPE2.Tx8_N
Tx8_P: C1015.1 ; port FAT_PIPE2.Tx8_P
Tx9_N: C1018.1 ; port FAT_PIPE2.Tx9_N
Tx9_P: C1019.1 ; port FAT_PIPE2.Tx9_P
Tx10_N: C1022.1 ; port FAT_PIPE2.Tx10_N
Tx10_P: C1023.1 ; port FAT_PIPE2.Tx10_P
Tx11_N: C1026.1 ; port FAT_PIPE2.Tx11_N
Tx11_P: C1027.1 ; port FAT_PIPE2.Tx11_P
NetIC84_A6: IC84.A6(MGTRREF_216) R713.2

Not connected (* = marked no-connect by the designer): OSC8 1(NC)*

### Layout directives
net class CLK: (no net found under the mark), ARTIX_FPGA_GTP_CLK_N, ARTIX_FPGA_GTP_CLK_P, ARTIX_FPGA_GTP_CLKC_N, ARTIX_FPGA_GTP_CLKC_P, CDR_CLK_CTRL.CDR_CLK_CLEAN1_N, CDR_CLK_CTRL.CDR_CLK_CLEAN1_P
net class MGT: (no net found under the mark)
net class MGT; net class GT: ARTIX_FPGA_GTP_Rx0_N, ARTIX_FPGA_GTP_Rx0_P, ARTIX_FPGA_GTP_Rx1_N, ARTIX_FPGA_GTP_Rx1_P, ARTIX_FPGA_GTP_Rx2_N, ARTIX_FPGA_GTP_Rx2_P, ARTIX_FPGA_GTP_Rx3_N, ARTIX_FPGA_GTP_Rx3_P, ARTIX_FPGA_GTP_Tx0C_N, ARTIX_FPGA_GTP_Tx0C_P, ARTIX_FPGA_GTP_Tx1C_N, ARTIX_FPGA_GTP_Tx1C_P, ARTIX_FPGA_GTP_Tx2C_N, ARTIX_FPGA_GTP_Tx2C_P, ARTIX_FPGA_GTP_Tx3C_N, ARTIX_FPGA_GTP_Tx3C_P, ARTIX_SoC_Rx0_N, ARTIX_SoC_Rx0_P, ARTIX_SoC_Rx1_N, ARTIX_SoC_Rx1_P, ARTIX_SoC_Tx0_N, ARTIX_SoC_Tx0_P, ARTIX_SoC_Tx1_N, ARTIX_SoC_Tx1_P, Rx8_N, Rx8_P, Rx9_N, Rx9_P, Rx10_N, Rx10_P, Rx11_N, Rx11_P, Tx8_N, Tx8_P, Tx9_N, Tx9_P, Tx10_N, Tx10_P, Tx11_N, Tx11_P
differential pair: ARTIX_FPGA_GTP_CLK_N, ARTIX_FPGA_GTP_CLK_P, ARTIX_FPGA_GTP_CLKC_N, ARTIX_FPGA_GTP_CLKC_P, ARTIX_FPGA_GTP_Rx0_N, ARTIX_FPGA_GTP_Rx0_P, ARTIX_FPGA_GTP_Rx1_N, ARTIX_FPGA_GTP_Rx1_P, ARTIX_FPGA_GTP_Rx2_N, ARTIX_FPGA_GTP_Rx2_P, ARTIX_FPGA_GTP_Rx3_N, ARTIX_FPGA_GTP_Rx3_P, ARTIX_FPGA_GTP_Tx0C_N, ARTIX_FPGA_GTP_Tx0C_P, ARTIX_FPGA_GTP_Tx1C_N, ARTIX_FPGA_GTP_Tx1C_P, ARTIX_FPGA_GTP_Tx2C_N, ARTIX_FPGA_GTP_Tx2C_P, ARTIX_FPGA_GTP_Tx3C_N, ARTIX_FPGA_GTP_Tx3C_P, ARTIX_SoC_Rx0_N, ARTIX_SoC_Rx0_P, ARTIX_SoC_Rx1_N, ARTIX_SoC_Rx1_P, ARTIX_SoC_Tx0_N, ARTIX_SoC_Tx0_P, ARTIX_SoC_Tx1_N, ARTIX_SoC_Tx1_P, CDR_CLK_CTRL.CDR_CLK_CLEAN1_N, CDR_CLK_CTRL.CDR_CLK_CLEAN1_P, Rx8_N, Rx8_P, Rx9_N, Rx9_P, Rx10_N, Rx10_P, Rx11_N, Rx11_P, Tx8_N, Tx8_P, Tx9_N, Tx9_P, Tx10_N, Tx10_P, Tx11_N, Tx11_P
net class FAT_PIPE2: ARTIX_FPGA_GTP_Rx0_N, ARTIX_FPGA_GTP_Rx0_P, ARTIX_FPGA_GTP_Rx1_N, ARTIX_FPGA_GTP_Rx1_P, ARTIX_FPGA_GTP_Rx2_N, ARTIX_FPGA_GTP_Rx2_P, ARTIX_FPGA_GTP_Rx3_N, ARTIX_FPGA_GTP_Rx3_P, ARTIX_FPGA_GTP_Tx0C_N, ARTIX_FPGA_GTP_Tx0C_P, ARTIX_FPGA_GTP_Tx1C_N, ARTIX_FPGA_GTP_Tx1C_P, ARTIX_FPGA_GTP_Tx2C_N, ARTIX_FPGA_GTP_Tx2C_P, ARTIX_FPGA_GTP_Tx3C_N, ARTIX_FPGA_GTP_Tx3C_P, Rx8_N, Rx8_P, Rx9_N, Rx9_P, Rx10_N, Rx10_P, Rx11_N, Rx11_P, Tx8_N, Tx8_P, Tx9_N, Tx9_P, Tx10_N, Tx10_P, Tx11_N, Tx11_P

### Notes on the sheet
- AC-coupled
- Project/Equipment
- Document
- Designer
- Drawn by
- Check.by
- Copyright WUT ISE 2021
  This documentation describes Open Hardware and is licensed under CERN OHL v.1.1. You may redistribute and modify this documentaction under the terms of the CERN OHL v1.1.
  (http://ohwr.org/CERNOHL). This documentation is dristributed WITHOUT ANY EXPRESS OR IMPLIED WARRANTY, INCLUDING OF MERCHANTABLITY, SATISFACTORY QUALITY AND FITNESS FOR A PARTICULAR PURPOSE. Please see the CERN OHL v.1.1 for applicable conditions
- File
- Last Mod.
- Print Date
- Sheet
- Size
- A3
- of
- Rev
- Contact:
- (in symbol R0402_100R_1%_0.0625W_100PPM) 1%
- (in symbol R0402_200R_1%_0.0625W_100PPM) 1%

### Library data of the parts
C902-C904 C909-C912 C1008-C1027 = CC0201_100NF_6.3V_10%_X5R: as C475 on sheet FPGA_7A35T; Case: 0201; Manufacturer Part Number: CC0201_100NF_6.3V_10%_X5R; Manufacturer1 Example: AVX; Part Number: CC0201_100NF_6.3V_10%_X5R; Pin Count: 2; SMD: Yes; Status: Not Recommended; Value: 100nF; Component Kind: Standard; Component Type: Standard; Mounted: Yes; Socket: No; Sense: No; Manufacturer1 ComponentHeight: 0.33mm; HelpURL: \\cern.ch\dfs\Applications\Altium\Datasheets\CC0201_X5R_AVX.pdf; Author: CERN DEM JLC; CreateDate: 03.12.2007; LatestRevisionDate: 03.12.2007
IC84 = CMP-0383-00015-1: as IC84 on sheet FPGA_7A35T; ComponentLink3URL: http://www.xilinx.com/support/documentation/user_guides/ug475_7Series_Pkg_Pinout.pdf; ComponentLink3Description: Pinout; Operating Temperature Range: Extended; PackageReference: CSG-325; PackageDescription: 324-Ball Wire-Bond Chip-Scale BGA, Body 15 x 15 mm, Pitch 0.8 mm; ComponentLink4URL: http://www.xilinx.com/support/documentation/user_guides/ug475_7Series_Pkg_Pinout.pdf; ComponentLink1Description: Manufacturer URL; ComponentLink2Description: Datasheet; DatasheetVersion: Rev. 1.15; PartNumber: XC7A35T-3CSG325E; Mounting Technology: Surface Mount; ComponentLink1URL: http://www.xilinx.com/; PackageVersion: Rev. 1.11; ComponentLink2URL: http://www.xilinx.com/support/documentation/data_sheets/ds180_7Series_Overview.pdf; Maximum Distributed RAM: 400 Kb; ComponentLink4Description: Package Specification
L68 = IND0402_MURATA_BLM15PX121SN1D: Manufacturer: MURATA; Part Description: SMD EMIFIL Chip Ferrite Bead; Power: 2A; Resistance: 0.055R; Tolerance: ±25%; Case: 0402; ComponentHeight: 0.55mm; Manufacturer Part Number: BLM15PX121SN1D; Part Number: IND0402_MURATA_BLM15PX121SN1D; Pin Count: 2; SMD: Yes; Value: 120R@100MHz; Component Kind: Standard; Component Type: Standard; Status: None; Mounted: Yes; Socket: No; Sense: No; HelpURL: \\cern.ch\dfs\Applications\Altium\Datasheets\IND0402_MURATA_BLM15PX.pdf; Author: CERN DEM JMW; CreateDate: 19.02.2014; LatestRevisionDate: 25.10.2018
OSC8 = OSC_125MHZ_SILICON-LAB_510FBA125M000AAG: Crystal Oscillator 6 pins, Si510 (LVDS/LVPECL/HCSL/Dual CMOS); Part Description: 2.5V ±25ppm LVDS Crystal Oscillator (XO), Si510 Series; Manufacturer: SILICON LABS; PressFit: No; Bonding: No; Part Number: OSC_125MHZ_SILICON-LAB_510FBA125M000AAG; Component Kind: Standard; Component Type: Standard; PackageDescription: Oscillator Si510 Series, 6 pins, 5x7mm; Value: 125MHz; Pin Count: 6; Mounted: Yes; Socket: No; SMD: Yes; Sense: No; ComponentHeight: 1.8mm; HelpURL: \\cern.ch\dfs\Applications\Altium\Datasheets\OSC_SILICON-LAB_SI510.pdf; Author: CERN DEM JMW; CreateDate: 10.08.2015; LatestRevisionDate: 26.11.2018
R713 = R0402_100R_1%_0.0625W_100PPM: Resistor - 1%; Manufacturer: GENERIC; Manufacturer1 Part Number: 232270671001L; Part Description: General Purpose Thick Film Chip Resistor; TC: ±100ppm/°C; PressFit: No; Case: 0402; Manufacturer Part Number: R0402_100R_1%_0.0625W_100PPM; Manufacturer1 ComponentHeight: 0.4mm; Manufacturer1 Example: YAGEO PHYCOMP; Part Number: R0402_100R_1%_0.0625W_100PPM; Pin Count: 2; Power: 0.0625W; Sense: No; SMD: Yes; Status: Not Recommended; Tolerance: ±1%; Value: 100; Component Kind: Standard; Component Type: Standard; Mounted: Yes; Socket: No; HelpURL: \\cern.ch\dfs\Applications\Altium\Datasheets\R0402_Phycomp_RC0402.pdf; Author: CERN DEM JLC; CreateDate: 03.12.2007; LatestRevisionDate: 17.10.2012
R714 R715 = R0402_200R_1%_0.0625W_100PPM: Resistor - 1%; Manufacturer: GENERIC; Manufacturer1 Part Number: 232270672001L; Part Description: General Purpose Thick Film Chip Resistor; TC: ±100ppm/°C; PressFit: No; Case: 0402; Manufacturer Part Number: R0402_200R_1%_0.0625W_100PPM; Manufacturer1 ComponentHeight: 0.4mm; Manufacturer1 Example: YAGEO PHYCOMP; Part Number: R0402_200R_1%_0.0625W_100PPM; Pin Count: 2; Power: 0.0625W; Sense: No; SMD: Yes; Status: Not Recommended; Tolerance: ±1%; Value: 200; Component Kind: Standard; Component Type: Standard; Mounted: Yes; Socket: No; HelpURL: \\cern.ch\dfs\Applications\Altium\Datasheets\R0402_Phycomp_RC0402.pdf; Author: CERN DEM JLC; CreateDate: 03.12.2007; LatestRevisionDate: 17.10.2012